# Altium schematic sheet headtracking.SchDoc
size A3; SheetNumber: 1; SheetTotal: 1
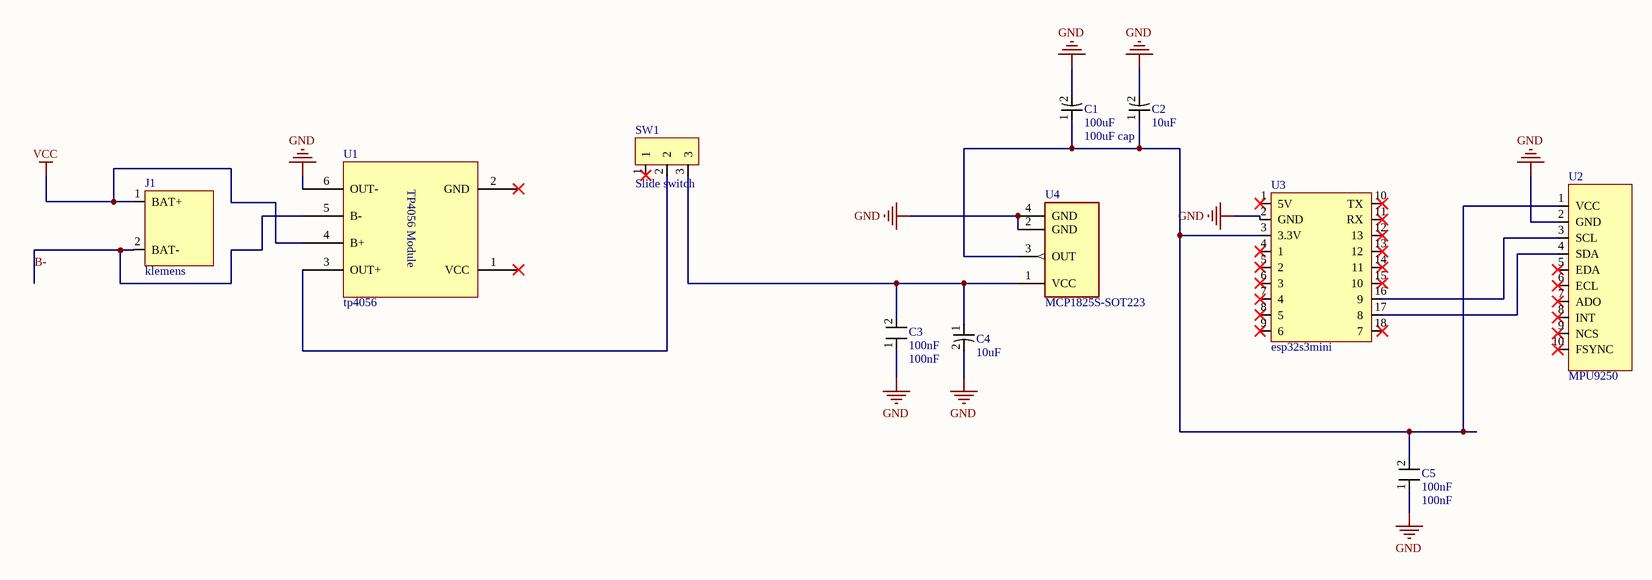
[diagram p0: headtracking.SchDoc]

## Parts
C1  100uF cap  value 100uF  [electrytic cap]
C2  10uF  [electrytic cap]
C3  100nF  [ceramic cap]
C4  10uF  [electrytic cap]
C5  100nF  [ceramic cap]
J1  klemens  [PCB_Klemens]
SW1  Slide switch  [slide switch]
U1  tp4056  [tp4056]
U2  MPU9250  [mpu9250]
U3  esp32s3mini  [ESP32_S3_MINI]
U4  MCP1825S-SOT223  [SOT-223 - regulator]

## Nets
GND: C1.2 C2.2 C3.1 C4.2 C5.1 U1.6(OUT-) U2.2(GND) U3.2(GND) U4.2(GND) U4.4(GND)
VCC: J1.1(BAT+) U1.4(B+)
B-: J1.2(BAT-) U1.5(B-)
NetC1_1: C1.1 C2.1 C5.2 U2.1(VCC) U3.3(3.3V) U4.3(OUT)
NetC3_2: C3.2 C4.1 SW1.3 U4.1(VCC)
NetSW1_2: SW1.2 U1.3(OUT+)
NetU2_3: U2.3(SCL) U3.16(9)
NetU2_4: U2.4(SDA) U3.17(8)

Not connected (* = marked no-connect by the designer): SW1 1*; U1 1(VCC)* 2(GND)*; U2 5(EDA)* 6(ECL)* 7(ADO)* 8(INT)* 9(NCS)* 10(FSYNC)*; U3 1(5V)* 4(1)* 5(2)* 6(3)* 7(4)* 8(5)* 9(6)* 10(TX)* 11(RX)* 12(13)* 13(12)* 14(11)* 15(10)* 18(7)*

## Notes on the sheet
- Title:
- Size:
- A3
- Page Number:
- Revision:
- Date:
- AHALTECH
- (in symbol tp4056) TP4056 Module

## Library data of the parts
C2 C4 = 10uF cap
C3 C5 = 100nf cap: value: 100nF
U4 = MCP1825S-SOT223: MF: Smartec; MP: SMT172-SOT223; SnapEDA_Link: https://www.snapeda.com/parts/SMT172-SOT223/Smartec/view-part/?ref=snap; Package: Package; Value: *; Check_prices: https://www.snapeda.com/parts/SMT172-SOT223/Smartec/view-part/?ref=eda